# EAGLE design ENC_SW_Frontpanel (EAGLE 6.2)
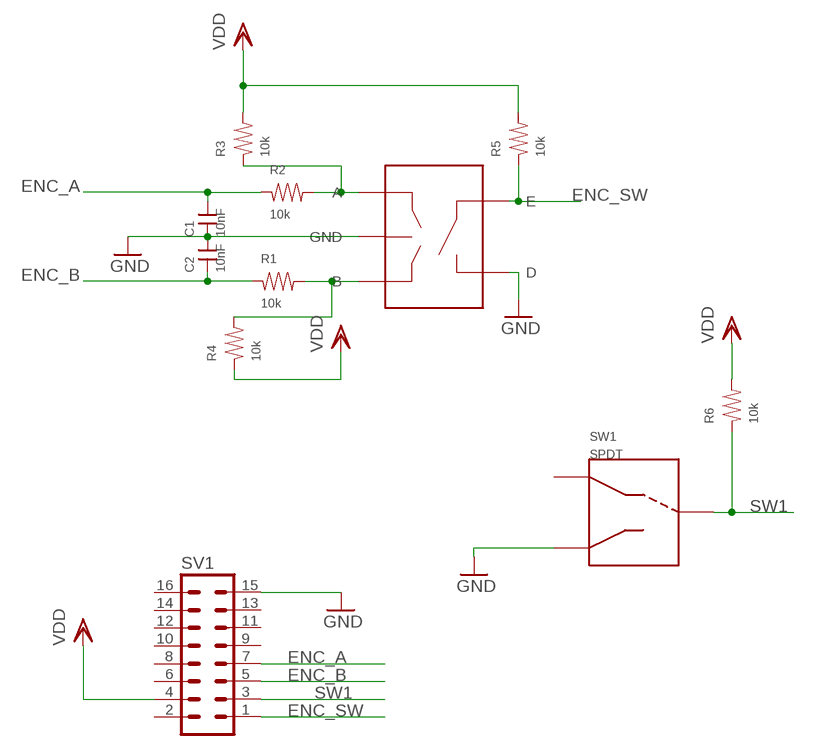
[diagram p0: schematic, sheet 1]

## Parts
C1  10nF  CAP0603  [0603]
C2  10nF  CAP0603  [0603]
ENC1  PEC09  [PEC092320FS]
R1  10k  RES0603  [0603]
R2  10k  RES0603  [0603]
R3  10k  RES0603  [0603]
R4  10k  RES0603  [0603]
R5  10k  RES0603  [0603]
R6  10k  RES0603  [0603]
SV1  ML16  [ML16]
SW1  SPDT  [100SP1-M7]

## Nets
ENC_A: C1.2 R2.1 SV1.7
ENC_B: C2.1 R1.1 SV1.5
ENC_SW: ENC1.E R5.1 SV1.1
GND: C1.1 C2.2 ENC1.C(GND) ENC1.D SV1.15 SW1.IN2
N$4: ENC1.B R1.2 R4.2
N$5: ENC1.A R2.2 R3.1
SW1: R6.1 SV1.3 SW1.OUT
VDD: R3.2 R4.1 R5.2 R6.2 SV1.4
Unconnected: SV1.2 SV1.6 SV1.8 SV1.9 SV1.10 SV1.11 SV1.12 SV1.13 SV1.14 SV1.16 SW1.IN1

## Library data of the parts
C1 C2 = rlc-jqi:CAP: SMT Capacitor
ENC1 = mcu-accessories:PEC09: PEC09-2320F-S0015 Rotary Encoder (Bourns).; PARTNO: PEC09-2320F-S0015-ND
R1-R6 = rlc-jqi:RES: SMT Resistor
SV1 = mcu-accessories:ML16: HARTING 2x8 (16 pin) ribbon connector.; OC_FARNELL: unknown; OC_NEWARK: unknown
SW1 = mcu-accessories:SPDT: 100-series SPDT switch: https://www.e-switch.com/system/asset/product_line/data_sheet/129/100.pdf; PARTNUM: 100SP1T1B1M7QE-ND

## Board
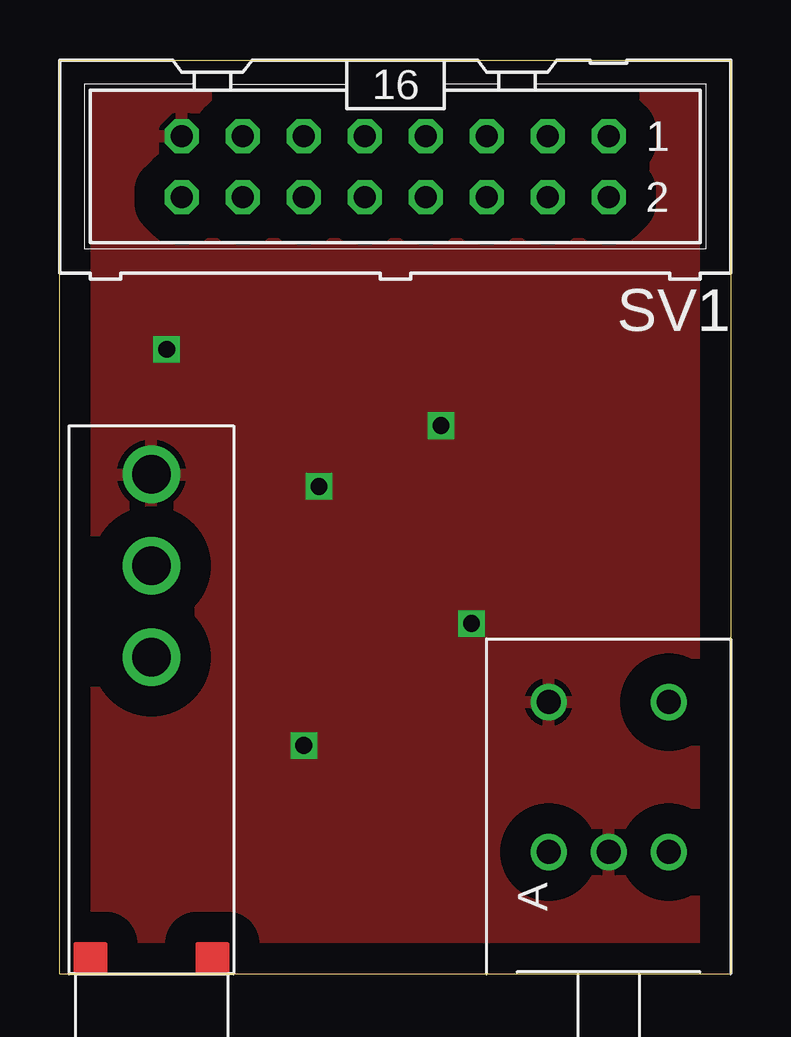
[diagram p1: board, top side]
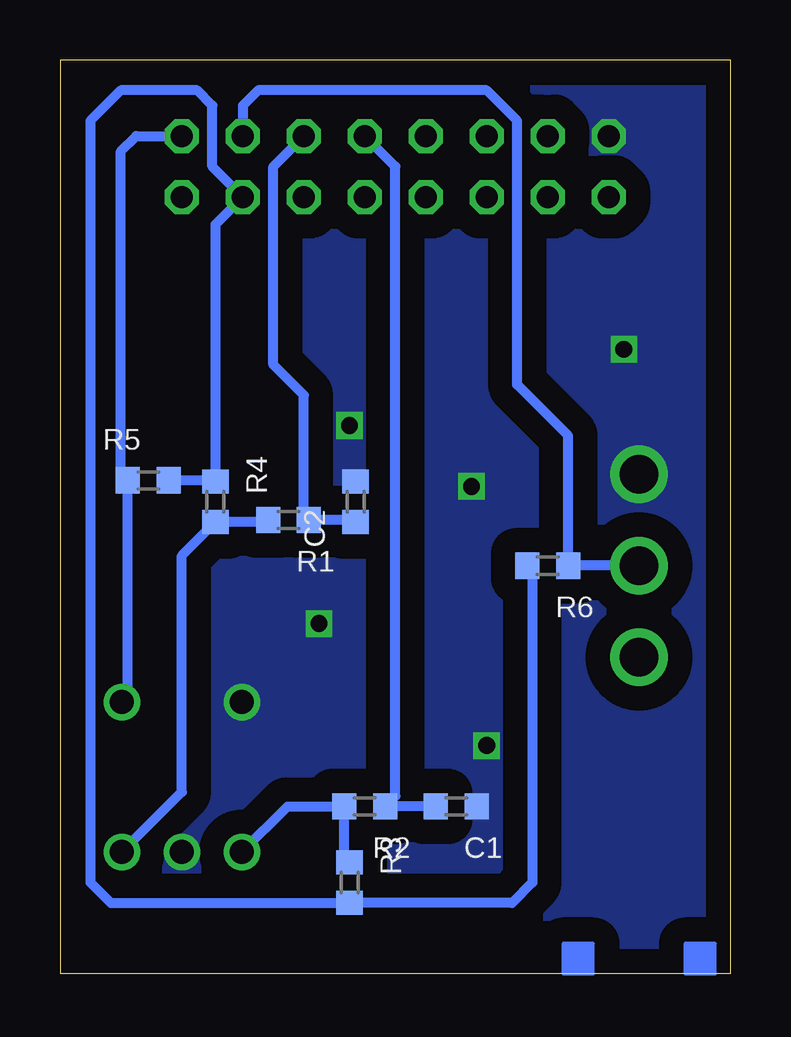
[diagram p2: board, bottom side, seen from below]

Size 27.94 x 38.1 mm. Coordinates in mm from the lower left corner, seen from the top.
Outline: 0,0 27.94,0 27.94,38.1 0,38.1 0,0
Copper layers (1*16): Top 0.035mm / dielectric 1.5mm / Bottom 0.035mm
Design rules: minimum track width 10mil, minimum drill 24mil, track to track 8mil, track to pad 8mil, pad to pad 8mil, via to via 8mil, smd to smd 8mil, copper to edge 40mil, drill to drill 8mil, minimum pad ring 10mil, minimum via ring 8mil, stop-mask expansion 4mil, vias tented up to drill 0mil, thermal gap 10mil

### Footprints (pad centres in the part's own frame; a part is rotated, then mirrored left to right if it is on the bottom)
0603 = smd 1 x 1.1: 1 -0.85,0; 2 0.85,0
PEC092320FS = drill 1: A 0,-2.5; B 0,2.5; C 0,0; D -6.25,-2.5; E -6.25,2.5
ML16 = drill 0.914 octagon: 1 -8.89,-1.27; 2 -8.89,1.27; 3 -6.35,-1.27; 4 -6.35,1.27; 5 -3.81,-1.27; 6 -3.81,1.27; 7 -1.27,-1.27; 8 -1.27,1.27; 9 1.27,-1.27; 10 1.27,1.27; 11 3.81,-1.27; 12 3.81,1.27; 13 6.35,-1.27; 14 6.35,1.27; 15 8.89,-1.27; 16 8.89,1.27
100SP1-M7 = drill 1.6: IN1 13.208,0; IN2 20.828,0; OUT 17.018,0

### Placement (x,y rotation side)
C1  11.43,6.99 180 bottom
C2  15.62,19.68 90 bottom
ENC1  22.86,5.08 270 top
R1  18.41,18.92 180 bottom
R2  15.24,6.99 180 bottom
R3  15.88,3.81 270 bottom
R4  21.46,19.68 270 bottom
R5  24.26,20.57 0 bottom
R6  7.62,17.02 180 bottom
SV1  13.97,33.66 180 top
SW1  3.81,0 90 top

### Tracks (layer width: path | path; a pad name or v marks a point on that pad's centre or on a via)
ENC_A
  Bottom 0.406: C1.2 R2.1 13.97,7.41 13.97,33.66 SV1.7
ENC_B
  Bottom 0.406: SV1.5 19.05,33.66 19.05,25.4 17.78,24.13 17.78,19.14 R1.1 15.71,18.92 C2.1
ENC_SW
  Bottom 0.406: ENC1.E 25.11,11.58 R5.1 25.4,20.87 25.4,34.29 24.77,34.92 SV1.1
GND  (via drill 0.7)
  other vias: 10.79,20.32 15.88,22.86 10.16,9.53 4.45,26.04 17.14,14.61
  pour Top (isolate 1.27): 0.64,38.1 40.01,38.1 40.01,0 0.64,0
  pour Bottom (isolate 1.016, no thermals): 0,38.1 27.94,38.1 27.94,0 0,0
N$4
  Bottom 0.406: ENC1.B 22.86,7.58 22.86,17.44 R4.2 19.35,18.84 R1.2
N$5
  Bottom 0.406: ENC1.A 18.46,6.99 R2.2 16.09,4.88 R3.1
SW1
  Bottom 0.406: SW1.OUT R6.1 6.77,22.44 8.89,24.56 8.89,35.56 10.16,36.83 19.68,36.83 20.32,36.2 SV1.3
VDD
  Bottom 0.406: R6.2 8.26,16.8 8.26,3.81 9.11,2.96 R3.2 25.82,2.96 26.67,3.81 26.67,35.56 25.4,36.83 22.23,36.83 21.59,36.2 21.59,33.66 SV1.4 21.46,31.24 R4.1 21.5,20.57 R5.2